# EAGLE design quad.decay.v1.0.2 (EAGLE 7.7.0)
VCA
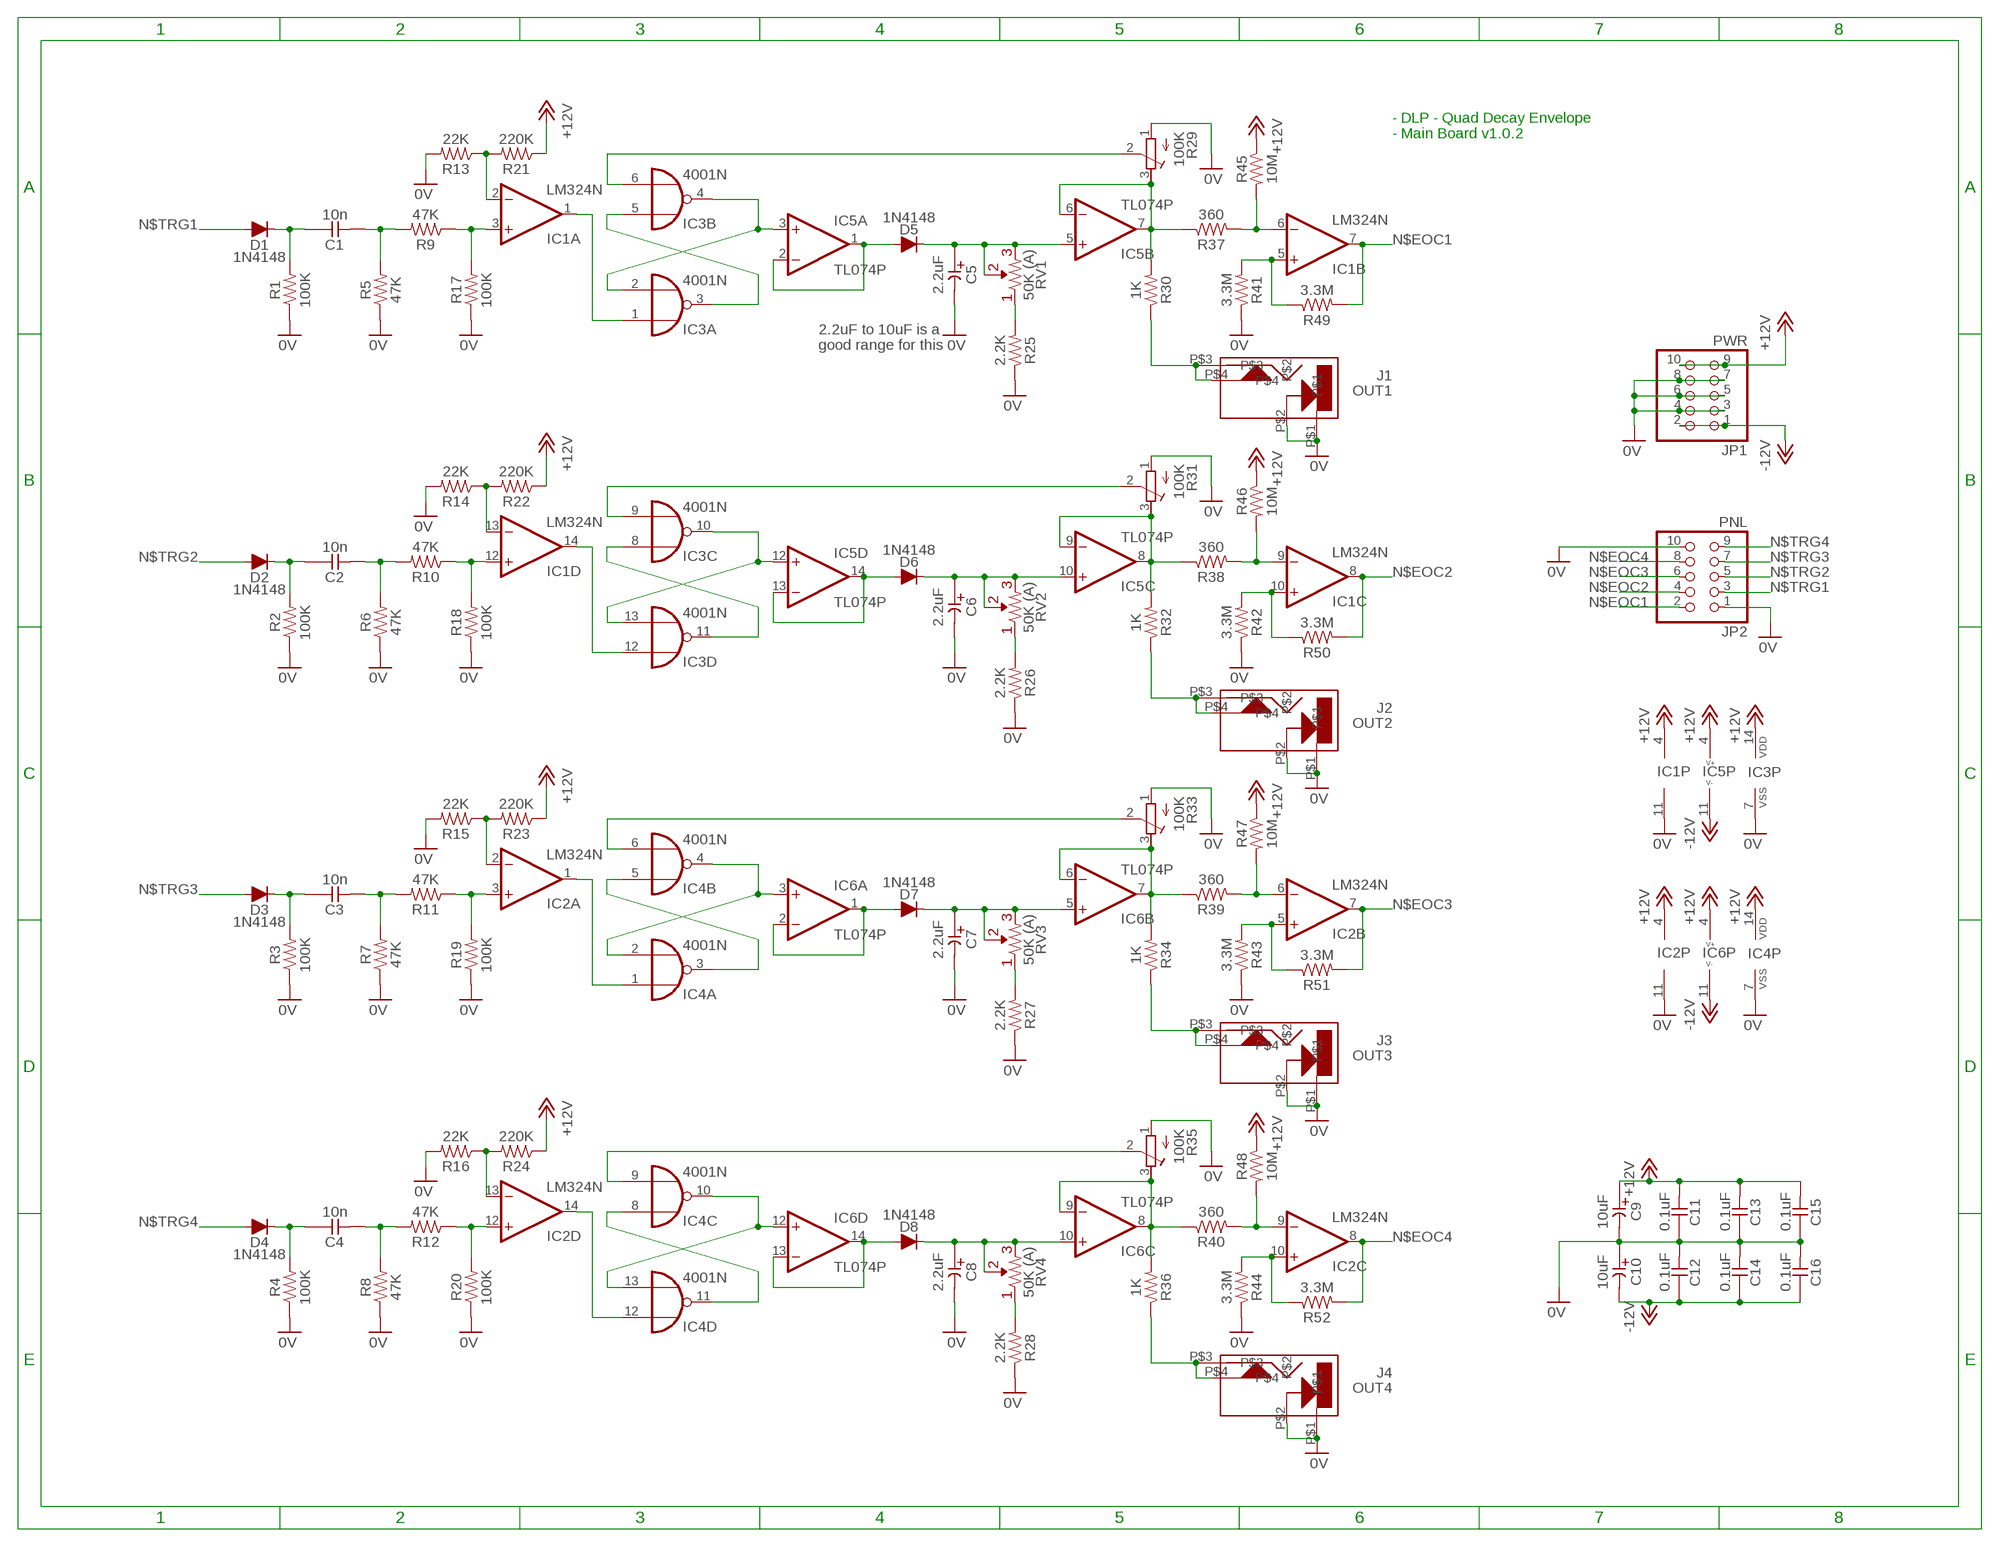
[diagram p0: schematic, sheet 1]

## Parts
C1  10n  CC-US025-024X044  [C025-024X044]
C2  10n  CC-US025-024X044  [C025-024X044]
C3  10n  CC-US025-024X044  [C025-024X044]
C4  10n  CC-US025-024X044  [C025-024X044]
C5  2.2uF  CE-USE2-5  [E2-5]
C6  2.2uF  CE-USE2-5  [E2-5]
C7  2.2uF  CE-USE2-5  [E2-5]
C8  2.2uF  CE-USE2-5  [E2-5]
C9  10uF  CE-USE2-5  [E2-5]
C10  10uF  CE-USE2-5  [E2-5]
C11  0.1uF  CC-US025-024X044  [C025-024X044]
C12  0.1uF  CC-US025-024X044  [C025-024X044]
C13  0.1uF  CC-US025-024X044  [C025-024X044]
C14  0.1uF  CC-US025-024X044  [C025-024X044]
C15  0.1uF  CC-US025-024X044  [C025-024X044]
C16  0.1uF  CC-US025-024X044  [C025-024X044]
D1  1N4148  [DO34-5]
D2  1N4148  [DO34-5]
D3  1N4148  [DO34-5]
D4  1N4148  [DO34-5]
D5  1N4148  [DO34-5]
D6  1N4148  [DO34-5]
D7  1N4148  [DO34-5]
D8  1N4148  [DO34-5]
IC1  LM324N  [DIL14]
IC2  LM324N  [DIL14]
IC3  4001N  [DIL14]
IC4  4001N  [DIL14]
IC5  TL074P  [DIL14]
IC6  TL074P  [DIL14]
J1  OUT1  CL1384  [CL1384]
J2  OUT2  CL1384  [CL1384]
J3  OUT3  CL1384  [CL1384]
J4  OUT4  CL1384  [CL1384]
JP1  PWR  PINHD-2X5  [2X05]
JP2  PNL  PINHD-2X5  [2X05]
R1  100K  R  [0207/7]
R2  100K  R  [0207/7]
R3  100K  R  [0207/7]
R4  100K  R  [0207/7]
R5  47K  R  [0207/7]
R6  47K  R  [0207/7]
R7  47K  R  [0207/7]
R8  47K  R  [0207/7]
R9  47K  R  [0207/7]
R10  47K  R  [0207/7]
R11  47K  R  [0207/7]
R12  47K  R  [0207/7]
R13  22K  R  [0207/7]
R14  22K  R  [0207/7]
R15  22K  R  [0207/7]
R16  22K  R  [0207/7]
R17  100K  R  [0207/7]
R18  100K  R  [0207/7]
R19  100K  R  [0207/7]
R20  100K  R  [0207/7]
R21  220K  R  [0207/7]
R22  220K  R  [0207/7]
R23  220K  R  [0207/7]
R24  220K  R  [0207/7]
R25  2.2K  R  [0207/7]
R26  2.2K  R  [0207/7]
R27  2.2K  R  [0207/7]
R28  2.2K  R  [0207/7]
R29  100K  R-TRIMM3339P  [RTRIM3339P]
R30  1K  R  [0207/7]
R31  100K  R-TRIMM3339P  [RTRIM3339P]
R32  1K  R  [0207/7]
R33  100K  R-TRIMM3339P  [RTRIM3339P]
R34  1K  R  [0207/7]
R35  100K  R-TRIMM3339P  [RTRIM3339P]
R36  1K  R  [0207/7]
R37  360  R  [0207/7]
R38  360  R  [0207/7]
R39  360  R  [0207/7]
R40  360  R  [0207/7]
R41  3.3M  R  [0207/7]
R42  3.3M  R  [0207/7]
R43  3.3M  R  [0207/7]
R44  3.3M  R  [0207/7]
R45  10M  R  [0207/7]
R46  10M  R  [0207/7]
R47  10M  R  [0207/7]
R48  10M  R  [0207/7]
R49  3.3M  R  [0207/7]
R50  3.3M  R  [0207/7]
R51  3.3M  R  [0207/7]
R52  3.3M  R  [0207/7]
RV1  50K (A)  R-VAR  [R-VAR]
RV2  50K (A)  R-VAR  [R-VAR]
RV3  50K (A)  R-VAR  [R-VAR]
RV4  50K (A)  R-VAR  [R-VAR]

## Nets
0V [pwr]: C5.- C6.- C7.- C8.- C9.- C10.+ C11.1 C12.2 C13.1 C14.2 C15.1 C16.2 IC1.11(P:V-) IC2.11(P:V-) IC3.7(P:VSS) IC4.7(P:VSS) J1.P$1 J1.P$2 J2.P$1 J2.P$2 J3.P$1 J3.P$2 J4.P$1 J4.P$2 JP1.3 JP1.4 JP1.5 JP1.6 JP1.7 JP1.8 JP2.1 JP2.10 R1.1 R2.1 R3.1 R4.1 R5.1 R6.1 R7.1 R8.1 R13.2 R14.2 R15.2 R16.2 R17.1 R18.1 R19.1 R20.1 R25.1 R26.1 R27.1 R28.1 R29.1(A) R31.1(A) R33.1(A) R35.1(A) R41.1 R42.1 R43.1 R44.1
+12V [pwr]: C9.+ C11.2 C13.2 C15.2 IC1.4(P:V+) IC2.4(P:V+) IC3.14(P:VDD) IC4.14(P:VDD) IC5.4(P:V+) IC6.4(P:V+) JP1.9 JP1.10 R21.1 R22.1 R23.1 R24.1 R45.1 R46.1 R47.1 R48.1
-12V [pwr]: C10.- C12.1 C14.1 C16.1 IC5.11(P:V-) IC6.11(P:V-) JP1.1 JP1.2
N$1: R25.2 RV1.R1
N$2: IC1.6(B:-IN) R37.2 R45.2
N$3: IC1.5(B:+IN) R41.2 R49.1
N$4: IC3.3(A:O) IC3.5(B:I0)
N$8: IC3.8(C:I0) IC3.11(D:O)
N$9: IC3.10(C:O) IC3.13(D:I1) IC5.12(D:+IN)
N$11: C2.1 D2.C R2.2
N$12: C2.2 R6.2 R10.2
N$13: IC1.12(D:+IN) R10.1 R18.2
N$14: IC3.2(A:I1) IC3.4(B:O) IC5.3(A:+IN)
N$16: IC1.13(D:-IN) R14.1 R22.2
N$17: D5.A IC5.1(A:OUT) IC5.2(A:-IN)
N$18: C1.1 D1.C R1.2
N$19: C1.2 R5.2 R9.2
N$20: IC1.3(A:+IN) R9.1 R17.2
N$21: IC1.2(A:-IN) R13.1 R21.2
N$22: IC1.1(A:OUT) IC3.1(A:I0)
N$23: IC5.6(B:-IN) IC5.7(B:OUT) R29.3(E) R30.2 R37.1
N$24: J1.P$3 J1.P$4 R30.1
N$25: IC3.6(B:I1) R29.2(S)
N$26: IC1.14(D:OUT) IC3.12(D:I0)
N$27: D6.A IC5.13(D:-IN) IC5.14(D:OUT)
N$28: IC5.8(C:OUT) IC5.9(C:-IN) R31.3(E) R32.2 R38.1
N$29: J2.P$3 J2.P$4 R32.1
N$30: IC3.9(C:I1) R31.2(S)
N$31: C6.+ D6.C IC5.10(C:+IN) RV2.R2 RV2.VAR
N$32: R26.2 RV2.R1
N$33: IC1.9(C:-IN) R38.2 R46.2
N$34: IC1.10(C:+IN) R42.2 R50.1
N$38: IC4.3(A:O) IC4.5(B:I0)
N$39: IC4.2(A:I1) IC4.4(B:O) IC6.3(A:+IN)
N$41: C3.1 D3.C R3.2
N$42: C3.2 R7.2 R11.2
N$43: IC2.3(A:+IN) R11.1 R19.2
N$44: IC2.2(A:-IN) R15.1 R23.2
N$45: IC2.1(A:OUT) IC4.1(A:I0)
N$46: D7.A IC6.1(A:OUT) IC6.2(A:-IN)
N$47: IC6.6(B:-IN) IC6.7(B:OUT) R33.3(E) R34.2 R39.1
N$48: J3.P$3 J3.P$4 R34.1
N$49: IC4.6(B:I1) R33.2(S)
N$50: C7.+ D7.C IC6.5(B:+IN) RV3.R2 RV3.VAR
N$51: R27.2 RV3.R1
N$52: IC2.6(B:-IN) R39.2 R47.2
N$53: IC2.5(B:+IN) R43.2 R51.1
N$57: IC4.8(C:I0) IC4.11(D:O)
N$58: IC4.10(C:O) IC4.13(D:I1) IC6.12(D:+IN)
N$60: C4.1 D4.C R4.2
N$61: C4.2 R8.2 R12.2
N$62: IC2.12(D:+IN) R12.1 R20.2
N$63: C5.+ D5.C IC5.5(B:+IN) RV1.R2 RV1.VAR
N$64: IC2.13(D:-IN) R16.1 R24.2
N$65: IC2.14(D:OUT) IC4.12(D:I0)
N$66: D8.A IC6.13(D:-IN) IC6.14(D:OUT)
N$67: IC6.8(C:OUT) IC6.9(C:-IN) R35.3(E) R36.2 R40.1
N$68: J4.P$3 J4.P$4 R36.1
N$69: IC4.9(C:I1) R35.2(S)
N$70: C8.+ D8.C IC6.10(C:+IN) RV4.R2 RV4.VAR
N$71: R28.2 RV4.R1
N$72: IC2.9(C:-IN) R40.2 R48.2
N$73: IC2.10(C:+IN) R44.2 R52.1
N$EOC1: IC1.7(B:OUT) JP2.2 R49.2
N$EOC2: IC1.8(C:OUT) JP2.4 R50.2
N$EOC3: IC2.7(B:OUT) JP2.6 R51.2
N$EOC4: IC2.8(C:OUT) JP2.8 R52.2
N$TRG1: D1.A JP2.3
N$TRG2: D2.A JP2.5
N$TRG3: D3.A JP2.7
N$TRG4: D4.A JP2.9

## Notes on the sheet
- - DLP - Quad Decay Envelope
  - Main Board v1.0.2
- 2.2uF to 10uF is a 
  good range for this

## Library data of the parts
C1-C4 C11-C16 = _common:CC-US: CAPACITOR, US symbol
C5-C10 = _common:CE-US: ELECTROLYTIC CAPACITOR, US symbol
D1-D8 = _common:1N4148: DIODE high speed (Philips)
IC1 IC2 = linear:LM324: OP AMP
IC3 IC4 = 40xx:4001: Quad 2-input NOR
IC5 IC6 = _common:TL074: OP AMP
J1-J4 = jacks:CL1384
JP1 JP2 = pinhead:PINHD-2X5: PIN HEADER
R1-R28 R30 R32 R34 R36-R52 = _common:R: RESISTOR, US symbol
R29 R31 R33 R35 = rcl:R-TRIMM: Trimm resistor
RV1-RV4 = _common:R-VAR

## Net classes
1 pwr: width 0.508 mm

## Board
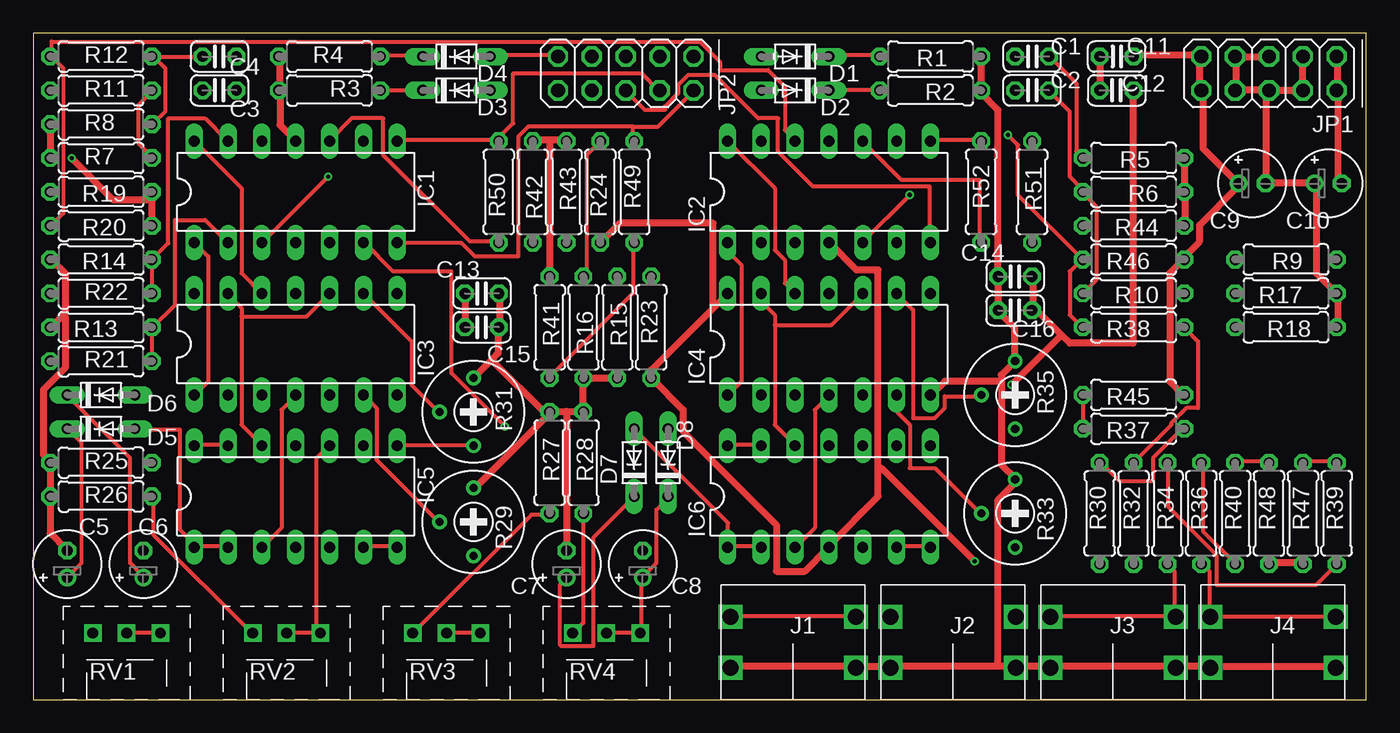
[diagram p1: board, top side]
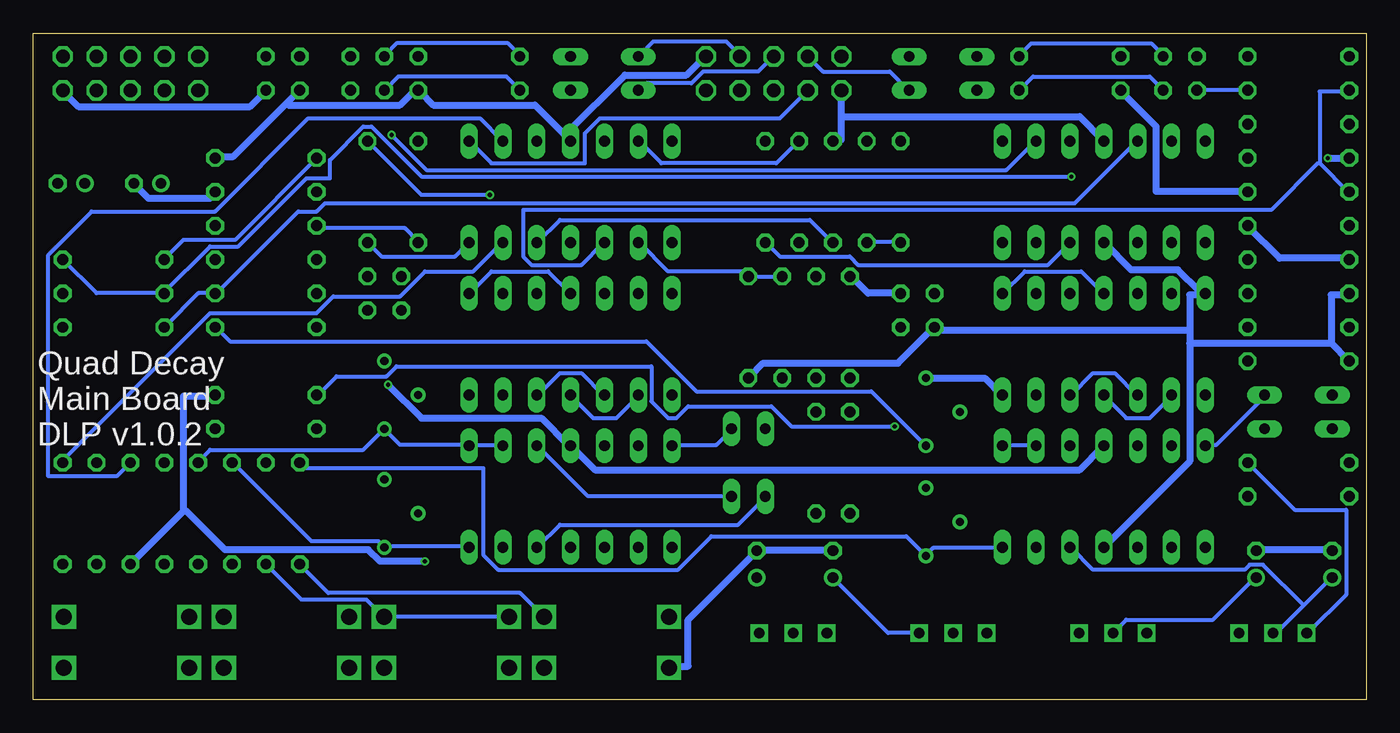
[diagram p2: board, bottom side, seen from below]

Size 100 x 50 mm. Coordinates in mm from the lower left corner, seen from the top.
Outline: 0,0 100,0 100,50 0,50 0,0
Copper layers (1*16): Top 0.035mm / dielectric 1.5mm / Bottom 0.035mm
Design rules "SeeedStudio_2layer_DRU_no_angle_20140221 *": minimum track width 12mil, minimum drill 12mil, track to track 6mil, track to pad 6mil, pad to pad 6mil, via to via 6mil, smd to smd 0mil, copper to edge 10mil, drill to drill 10mil, minimum pad ring 10mil, minimum via ring 6mil, stop-mask expansion 2mil, vias tented up to drill 100mil, thermal gap 10mil

### Footprints (pad centres in the part's own frame; a part is rotated, then mirrored left to right if it is on the bottom)
C025-024X044 = drill 0.813 octagon: 1 -1.27,0; 2 1.27,0
E2-5 = drill 0.813 pad 1.27: + -1.016,0 | drill 0.813 pad 1.27 octagon: - 1.016,0
DO34-5 = drill 0.813 long: A 2.54,0; C -2.54,0
DIL14 = drill 0.813 long: 1 -7.62,-3.81; 2 -5.08,-3.81; 3 -2.54,-3.81; 4 0,-3.81; 5 2.54,-3.81; 6 5.08,-3.81; 7 7.62,-3.81; 8 7.62,3.81; 9 5.08,3.81; 10 2.54,3.81; 11 0,3.81; 12 -2.54,3.81; 13 -5.08,3.81; 14 -7.62,3.81
CL1384 = drill 1.2 square: P$1 0,0; P$2 9.4,0; P$3 0,-3.8; P$4 9.4,-3.8
2X05 = drill 1.016 octagon: 1 -5.08,-1.27; 2 -5.08,1.27; 3 -2.54,-1.27; 4 -2.54,1.27; 5 0,-1.27; 6 0,1.27; 7 2.54,-1.27; 8 2.54,1.27; 9 5.08,-1.27; 10 5.08,1.27
0207/7 = drill 0.813 octagon: 1 -3.81,0; 2 3.81,0
RTRIM3339P = drill 0.61: 1 -2.54,0; 2 0,-2.54; 3 2.54,0
R-VAR = drill 0.8 square: R1 -2.54,0; R2 2.54,0; VAR 0,0

### Placement (x,y rotation side)
C1  74.93,48.26 0 top
C2  74.93,45.72 0 top
C3  13.97,45.72 180 top
C4  13.97,48.26 180 top
C5  2.54,10.16 90 top
C6  8.26,10.16 90 top
C7  40.01,10.16 90 top
C8  45.72,10.16 90 top
C9  91.44,38.73 0 top
C10  97.16,38.73 0 top
C11  81.28,48.26 0 top
C12  81.28,45.72 180 top
C13  33.66,30.48 180 top
C14  73.66,31.75 180 top
C15  33.66,27.94 180 top
C16  73.66,29.21 180 top
D1  57.15,48.26 180 top
D2  57.15,45.72 180 top
D3  31.75,45.72 0 top
D4  31.75,48.26 0 top
D5  5.08,20.32 0 top
D6  5.08,22.86 0 top
D7  45.09,17.78 90 top
D8  47.62,17.78 90 top
IC1  19.68,38.1 0 top
IC2  59.69,38.1 0 top
IC3  19.68,26.67 0 top
IC4  59.69,26.67 0 top
IC5  19.68,15.24 0 top
IC6  59.69,15.24 0 top
J1  61.7,2.4 180 top
J2  73.7,2.4 180 top
J3  85.7,2.4 180 top
J4  97.7,2.4 180 top
JP1  92.71,46.99 180 top
JP2  44.45,46.99 180 top
R1  67.31,48.26 180 top
R2  67.31,45.72 180 top
R3  22.23,45.72 0 top
R4  22.23,48.26 0 top
R5  82.55,40.64 180 top
R6  82.55,38.1 180 top
R7  5.08,40.64 0 top
R8  5.08,43.18 0 top
R9  93.98,33.02 180 top
R10  82.55,30.48 180 top
R11  5.08,45.72 0 top
R12  5.08,48.26 0 top
R13  5.08,27.94 180 top
R14  5.08,33.02 180 top
R15  43.81,27.94 270 top
R16  41.27,27.94 270 top
R17  93.98,30.48 180 top
R18  93.98,27.94 180 top
R19  5.08,38.1 180 top
R20  5.08,35.56 180 top
R21  5.08,25.4 0 top
R22  5.08,30.48 0 top
R23  46.35,27.94 90 top
R24  42.55,38.1 90 top
R25  5.08,17.78 0 top
R26  5.08,15.24 0 top
R27  38.73,17.78 270 top
R28  41.27,17.78 270 top
R29  33.02,13.34 270 top
R30  80.01,13.97 90 top
R31  33.02,21.59 270 top
R32  82.55,13.97 90 top
R33  73.66,13.97 270 top
R34  85.09,13.97 90 top
R35  73.66,22.86 270 top
R36  87.63,13.97 90 top
R37  82.55,20.32 180 top
R38  82.55,27.94 180 top
R39  97.79,13.97 90 top
R40  90.17,13.97 90 top
R41  38.73,27.94 270 top
R42  37.47,38.1 270 top
R43  40.01,38.1 270 top
R44  82.55,35.56 180 top
R45  82.55,22.86 180 top
R46  82.55,33.02 180 top
R47  95.25,13.97 90 top
R48  92.71,13.97 90 top
R49  45.09,38.1 90 top
R50  34.92,38.1 90 top
R51  74.93,38.1 270 top
R52  71.12,38.1 90 top
RV1  7,5 0 top
RV2  19,5 0 top
RV3  31,5 0 top
RV4  43,5 0 top

### Tracks (layer width: path | path; a pad name or v marks a point on that pad's centre or on a via)
0V  (via drill 0.3)
  Top 0.508: R1.1 71.12,45.75 R2.1 71.12,45.5 72.38,44.25 72.38,32 C14.2 72.38,31.75 72.38,29.25 C16.2 72.5,29 73.62,27.88 73.62,25.62 R35.1 73.62,25.38 72.62,24.38 72.62,23.88 | C12.2 80,45.75 C11.1 | R44.1 86.38,35.62 86.38,38 R6.1 86.38,38.25 86.38,40.62 R5.1 | JP1.6 92.62,45.75 90.25,45.75 JP1.8 90.25,46 90.25,48.25 JP1.7 90.5,48.25 92.62,48.25 JP1.5 | JP1.6 92.88,45.75 95.25,45.75 JP1.4 JP1.3 | R18.1 97.88,28 97.88,30.38 R17.1 97.62,30.62 96.25,32 96.25,38.5 C10.+ 96.12,38.75 92.5,38.75 C9.- 92.5,39 92.5,45.5 JP1.6 | C5.- 2.5,11.25 1.25,12.5 1.25,15 R26.1 1.25,15.25 1.25,17.75 R25.1 1.12,18 0.75,18.38 0.75,23.25 2.38,24.88 2.38,28.75 2.25,28.88 | IC1.11 19.62,42 18.5,43.12 18.5,45.62 R3.1 18.5,45.88 18.5,48.25 R4.1 | R7.1 1.25,40.75 1.25,43.12 R8.1 | R20.1 8.88,35.62 8.88,38 R19.1 8.62,37.5 6,37.5 v2.88,40.62 | 2.25,28.88 2.38,29 2.38,32 1.38,33 R14.2 | 2.25,28.88 1.38,28 R13.2 | R29.1 33.12,15.88 38.62,21.38 38.62,21.5 R27.1 | 40,21.62 38.88,21.62 R27.1 | 40,21.62 41.25,21.62 R28.1 41.25,21.88 41.25,24.12 R16.2 41.5,24.12 43.75,24.12 R15.2 | 40,21.62 40,11.25 C7.- | 38.75,42 40,42 R43.1 | 38.75,42 37.5,42 R42.1 | 34.38,25.5 34.88,26 34.88,27.88 C15.1 35,28.12 35,30.38 C13.1 | 34.38,25.5 33.12,24.25 R31.1 | 38.75,42 38.75,31.75 R41.1 | 34.38,25.5 38.38,21.5 R27.1 | 72.62,23.88 72.62,17.62 73.62,16.62 R33.1 73.62,16.25 72.38,15 72.38,2.5 | 72.62,23.88 68.38,23.88 67.38,22.88 IC4.7 | J1.P$2 52.38,2.5 61.62,2.5 J1.P$1 61.88,2.5 64.25,2.5 J2.P$2 64.5,2.5 72.38,2.5 | J4.P$1 97.62,2.5 88.5,2.5 J4.P$2 88.25,2.5 85.75,2.5 J3.P$1 85.5,2.5 76.5,2.5 J3.P$2 76.25,2.5 73.75,2.5 J2.P$1 73.5,2.5 72.38,2.5
  Bottom 0.508: JP2.1 49.62,48.25 51,46.88 55.62,46.88 60,42.5 IC2.11 59.75,42 62.38,44.62 70,44.62 71,45.62 R2.1 71.38,45.75 72.5,44.62 80.88,44.62 81,44.75 | 81,44.75 85,40.75 86.25,40.75 R5.1 | 81,44.75 80.12,45.62 C12.2 | R6.1 86.38,38 86.75,37.62 91.38,37.62 92.38,38.62 C9.- | C6.- 8.25,11.25 2.62,11.25 C5.- | R20.1 8.88,35.5 6.5,33.12 1.38,33.12 R14.2 | v2.88,40.62 1.38,40.62 R7.1 | R3.1 18.38,45.62 15.75,43 15.75,38.12 9,38.12 R19.1 | C7.- 40.12,11.25 45.62,11.25 C8.- 45.88,11 50.88,6 50.88,2.5 52.25,2.5 J1.P$2 | 39.38,43.75 39.38,42 40,42 R43.1 | 39.38,43.75 39.38,45.62 JP2.10 | IC3.7 27.38,22.88 28.62,24.12 33,24.12 R31.1 | R41.1 38.62,31.75 37.38,30.5 35,30.5 C13.1 | 39.38,43.75 21.5,43.75 19.75,42 IC1.11
+12V  (via drill 0.3)
  Top 0.508: C11.2 82.62,48.38 87.62,48.38 JP1.9 87.5,48.12 87.5,45.88 JP1.10 87.75,45.62 87.75,41.38 90.38,38.75 C9.+ 90.38,38.5 87.5,35.62 87.5,34.38 86.38,33.25 R46.1 86.25,33 85.25,32 85.25,23.88 86.25,22.88 R45.1 | R48.1 92.75,10.25 95.25,10.25 R47.1 | C15.2 32.38,28 32.38,30.38 C13.2 | 51.12,29.5 46.38,24.75 46.38,24.38 R23.1 46.38,24.12 48.75,21.75 48.75,20.12 55.75,13.12 55.75,9.62 57.88,9.62 59.62,11.38 IC6.4 59.75,11.62 63.38,15.25 63.38,17.38 | 51.12,29.5 52,30.38 IC4.14 | R24.1 42.62,34.38 44,35.75 51,35.75 51,29.62 51.12,29.5 | 63.38,17.38 63.38,32.25 61.75,32.25 59.75,34.25 IC2.4 | v70.62,10.38 63.62,17.38 63.38,17.38
  Bottom 0.508: 88.75,14.12 92.62,10.25 R48.1 | 88.75,14.12 88.75,22.75 86.38,22.75 R45.1 | 2.62,26.75 1.38,25.5 R21.1 | 2.62,26.75 2.62,30.38 1.38,30.38 R22.1 | 13.25,27.75 13.25,30.38 12.12,30.38 IC3.14 12.5,30.62 14.12,32.25 17.62,32.25 19.62,34.25 IC1.4 | 13.25,27.75 13.25,26.75 | 13.25,26.75 13.25,17.88 19.62,11.5 IC5.4 | 13.25,26.75 2.62,26.75 | R23.1 46.25,24.25 45.25,25.25 35.12,25.25 32.5,27.88 C15.2 32.25,27.75 13.25,27.75 | v70.62,10.38 74,10.38 74.88,11.25 85.62,11.25 88.5,14.12 88.75,14.12
-12V  (via drill 0.3)
  Top 0.508: C14.1 75,31.75 75,29.25 C16.1 75.25,29.25 77.12,27.38 | C10.- 98.12,38.75 97.88,39 97.88,45.62 JP1.2 97.88,45.88 97.88,48.25 JP1.1 | 77.12,27.38 77.75,26.75 82.5,26.75 82.5,45.62 C12.1 | 77.12,27.38 v73.38,23.62
  Bottom 0.508: IC5.11 19.75,19 21.5,17.25 57.88,17.25 59.62,19 IC6.11 59.88,19.12 61.88,21.12 70.88,21.12 v73.38,23.62 | C12.1 82.62,45.62 83.75,44.5 96.62,44.5 97.75,45.62 JP1.2
N$1
  Bottom 0.305: RV1.R1 4.38,5 1.5,7.88 1.5,14.25 5.38,14.25 8.88,17.75 R25.2
N$2  (via drill 0.3)
  Top 0.305: R37.2 78.75,20.38 78.75,22.75 R45.2 | v35.38,20.5 31.38,24.5 31.38,32.12 27,32.12 24.88,34.25 IC1.6
  Bottom 0.305: v35.38,20.5 43.12,20.5 44.62,22 50.88,22 51.75,21.12 52.38,21.12 53.62,22.38 53.62,25 72.75,25 73.5,24.25 77.25,24.25 78.62,22.88 R45.2
N$3
  Top 0.305: R41.2 38.75,24.25 45,30.5 45,34.25 R49.1
  Bottom 0.305: IC1.5 22.25,34.25 23.88,32.62 38.12,32.62 38.75,33.25 44,33.25 45,34.25 R49.1
N$4
  Bottom 0.305: IC3.3 17.25,22.88 18.88,24.5 20.5,24.5 22.12,22.88 IC3.5
N$8
  Bottom 0.305: IC3.11 19.75,30.5 21.38,32.12 25.62,32.12 27.25,30.5 IC3.8
N$9
  Top 0.305: 15.62,28.75 15.62,29.38 14.62,30.38 IC3.13 | 15.62,28.75 15.62,20.62 17.12,19.12 IC5.12 | 15.62,28.75 20.5,28.75 22.12,30.38 IC3.10
N$11
  Top 0.305: D2.C 59.75,45.75 63.5,45.75 R2.2
  Bottom 0.305: C2.1 73.62,45.75 72.62,46.75 64.5,46.75 63.5,45.75 R2.2
N$12
  Top 0.305: R10.2 78.75,30.5 79.75,31.5 79.75,37 78.75,38 R6.2 78.75,38.25 77.75,39.25 77.75,44.12 76.25,45.62 C2.2
N$13
  Bottom 0.305: IC1.12 17.25,41.88 21.88,37.25 78.12,37.25 78.75,36.62 80.12,36.62 86.25,30.5 R10.1 86.5,30.5 87.62,30.5 90.12,28 R18.2
N$14
  Top 0.305: IC5.3 17.25,11.5 18.62,12.88 18.62,21.75 19.62,22.75 IC3.4
  Bottom 0.305: IC3.2 14.62,22.75 16.25,21.12 18,21.12 19.62,22.75 IC3.4
N$16
  Top 0.305: R22.2 8.88,30.5 8.88,33 R14.1 9,33.12 10.12,34.25 10.12,43.62 12.88,43.62 14.5,42 IC1.13
N$17
  Top 0.305: IC5.2 14.5,11.5 12.12,11.5 IC5.1 12.12,11.62 11,12.75 11,20.25 7.62,20.25 D5.A
N$18
  Top 0.305: D1.C 59.75,48.38 63.5,48.38 R1.2
  Bottom 0.305: C1.1 73.62,48.38 72.75,49.25 64.38,49.25 63.5,48.38 R1.2
N$19
  Top 0.305: R5.2 78.62,40.75 78.25,41.12 78.25,46.25 76.25,48.25 C1.2
  Bottom 0.305: R9.2 90.12,33.12 88.75,34.5 84.88,34.5 78.75,40.62 R5.2
N$20  (via drill 0.3)
  Top 0.305: v22.12,39.25 17.25,34.38 IC1.3
  Bottom 0.305: v22.12,39.25 70.88,39.25 74.62,43 75.25,43 77.75,40.5 77.75,39.12 79.5,39.12 84.62,34 86.75,34 90.25,30.5 R17.2 90.38,30.5 95.25,30.5 97.75,33 R9.1
N$21
  Top 0.305: R21.2 8.88,25.5 8.88,27.88 R13.1 9,28 10.62,29.62 10.62,36 12.88,36 14.5,34.38 IC1.2
N$22
  Top 0.305: IC3.1 12.12,22.88 13.12,23.88 13.12,33.25 12.12,34.25 IC1.1
N$23
  Top 0.305: IC5.6 24.88,11.5 27.25,11.5 IC5.7 | R30.2 80.12,17.75 81.5,16.38 84,16.38 84,18.12 86.25,20.38 R37.1
  Bottom 0.305: IC5.7 27.38,11.38 32.5,11.38 33,10.88 R29.3 33.12,10.88 34.5,12.25 49.12,12.25 51.62,9.75 65.12,9.75 66.25,10.88 66.25,17.38 79.62,17.38 80,17.75 R30.2
N$24
  Top 0.305: J1.P$4 52.38,6.25 61.62,6.25 J1.P$3
  Bottom 0.305: J1.P$3 63.5,8 77.88,8 80,10.12 R30.1
N$25
  Top 0.305: IC3.6 25.75,21.88 25.75,18 30.38,13.38 R29.2
N$26
  Top 0.305: IC3.12 15.62,32 15.62,38.38 12.12,41.88 IC1.14
N$27
  Top 0.305: IC5.14 12.12,19.12 14.5,19.12 IC5.13
  Bottom 0.305: D6.A 7.62,22.75 11.25,19.12 12,19.12 IC5.14
N$28
  Top 0.305: R31.3 33,19.12 27.38,19.12 IC5.8 | R32.2 82.62,17.88 85.38,20.62 85.38,20.75 86.5,21.88 87.38,21.88 87.38,26.88 86.38,27.88 R38.1
  Bottom 0.305: IC5.9 24.88,19.12 27.25,19.12 IC5.8 | R31.3 33.12,19.12 37.12,23.12 50.25,23.12 54,26.88 85.25,26.88 86.25,27.88 R38.1
N$29
  Bottom 0.305: R32.1 82.5,10.12 79.88,7.5 75,7.5 J2.P$3 73.62,6.25 64.38,6.25 J2.P$4
N$30
  Top 0.305: R31.2 30.38,21.62 28.38,23.62 28.38,26.88 24.88,30.38 IC3.9
N$31
  Top 0.305: RV2.VAR RV2.R2 21.25,5.12 21.25,18.12 22.12,19 IC5.10 | D6.C 2.62,22.75 7.25,18.12 7.25,10.25 8.25,9.25 C6.+
  Bottom 0.305: RV2.VAR 18,6 11.5,6 8.38,9.12 C6.+
N$32
  Top 0.305: RV2.R1 16.38,5 9,12.38 9,15.12 R26.2
N$33  (via drill 0.3)
  Top 0.305: R38.2 78.62,28 77.75,28.88 77.75,32.12 78.62,33 R46.2 78.62,33.12 73.88,37.88 73.88,41.62 v73.12,42.38
  Bottom 0.305: v73.12,42.38 70.5,39.75 27,39.75 24.88,41.88 IC1.9
N$34
  Top 0.305: IC1.10 22.25,42 23.88,43.62 26.25,43.62 26.25,40.88 32.75,34.38 34.88,34.38 R50.1
  Bottom 0.305: R50.1 35,34.38 37.38,34.38 R42.2
N$38
  Bottom 0.305: IC4.3 57.25,22.88 58.88,24.5 60.5,24.5 62.12,22.88 IC4.5
N$39
  Top 0.305: IC6.3 57.25,11.5 58.62,12.88 58.62,21.75 59.62,22.75 IC4.4
  Bottom 0.305: IC4.2 54.62,22.75 56.25,21.12 58,21.12 59.62,22.75 IC4.4
N$41
  Top 0.305: D3.C 29.12,45.75 26.12,45.75 R3.2
  Bottom 0.305: C3.1 15.25,45.75 16.25,46.75 25,46.75 26,45.75 R3.2
N$42
  Top 0.305: R7.2 8.88,40.75 7.88,41.75 7.88,44.62 8.88,45.62 R11.2
  Bottom 0.305: C3.2 12.62,45.75 9,45.75 R11.2
N$43
  Bottom 0.305: 3.5,40.25 1.38,38.12 R19.2 | 3.5,40.25 3.5,45.62 1.38,45.62 R11.1 | IC2.3 57.25,34.25 58.88,32.62 62.62,32.62 63.25,33.25 63.25,36.75 7.12,36.75 3.62,40.25 3.5,40.25
N$44
  Bottom 0.305: R15.1 R23.2 46.5,31.75 46.88,32.12 52.38,32.12 54.5,34.25 IC2.2
N$45
  Top 0.305: IC4.1 52.12,22.88 53.12,23.88 53.12,32.62 52.12,33.62 52.12,34.25 IC2.1
N$46
  Top 0.305: IC6.2 54.5,11.5 52.12,11.5 IC6.1 52.12,11.62 52.12,13.25 45.12,20.25 D7.A
N$47
  Top 0.305: IC6.6 64.88,11.5 67.25,11.5 IC6.7 | R39.1 97.75,10.12 96.25,8.62 88.75,8.62 88.75,10.88 85.12,14.5 85.12,17.75 R34.2
  Bottom 0.305: IC6.7 67.38,11.5 73.62,11.5 R33.3 73.75,11.5 74.12,11.88 79.12,11.88 85,17.75 R34.2
N$48
  Top 0.305: R34.1 85.62,9.62 85.62,6.25 J3.P$3 85.5,6.25 76.38,6.25 J3.P$4
N$49
  Top 0.305: R33.2 71,14 67.62,17.38 65.75,17.38 65.75,20.62 64.88,21.5 64.88,22.75 IC4.6
N$50
  Top 0.305: RV3.R2 RV3.VAR | C7.+ 40,9.12 39.5,8.62 39.5,4.12 39.62,4 42,4 42,12.12 45,15.12 D7.C
  Bottom 0.305: RV3.R2 35.88,5 40,9.12 C7.+ | D7.C 45.12,15.12 47.12,13.12 60.5,13.12 62.12,11.5 IC6.5
N$51
  Top 0.305: RV3.R1 28.5,5 37.38,13.88 38.62,13.88 R27.2
N$52
  Top 0.305: R47.2 95.25,17.88 97.75,17.88 R39.2
  Bottom 0.305: IC2.6 64.88,34.25 67,32.12 70.62,32.12 72.5,30.25 77.5,30.25 78.75,29 86.75,29 97.88,17.88 R39.2
N$53  (via drill 0.3)
  Top 0.305: v65.75,37.88 62.25,34.38 IC2.5
  Bottom 0.305: R43.2 40.12,34.38 41.75,36 60.5,36 62.12,34.38 IC2.5 | v65.75,37.88 70.88,37.88 74.88,41.88 R51.1
N$57
  Bottom 0.305: IC4.11 59.75,30.5 61.38,32.12 65.62,32.12 67.25,30.5 IC4.8
N$58
  Top 0.305: 55.62,28.12 55.62,28.88 54.62,29.88 54.62,30.38 IC4.13 | 55.62,28.12 55.62,20.62 57.12,19.12 IC6.12 | IC4.10 59.88,28.12 55.62,28.12
N$60
  Top 0.305: D4.C 29.12,48.38 26.12,48.38 R4.2
  Bottom 0.305: C4.1 15.25,48.38 16.12,49.25 25.12,49.25 26,48.38 R4.2
N$61
  Top 0.305: R8.2 9,43.25 9.88,44.12 9.88,47.38 9,48.25 R12.2 9.12,48.25 12.62,48.25 C4.2
N$62
  Top 0.305: R20.2 1.38,35.62 2.25,36.5 2.25,47.38 1.38,48.25 R12.1 1.38,48.38 1.38,49.38 50,49.38 51.5,47.88 51.5,47.25 55.12,47.25 56.38,46 56.38,42.75 57.12,42 IC2.12
N$63
  Top 0.305: RV1.R2 RV1.VAR | D5.C 2.62,20.25 3.62,19.25 3.62,10.25 2.62,9.25 C5.+
  Bottom 0.305: 4.69,7.06 6.75,5 RV1.VAR | 4.69,7.06 2.62,9.12 C5.+ | 4.69,7.06 7.75,10.12 8.75,10.12 9.12,9.75 20.5,9.75 22.12,11.38 IC5.5
N$64
  Top 0.305: R16.1 41.38,31.75 41.5,31.88 41.5,40.88 42.5,41.88 R24.2
  Bottom 0.305: IC2.13 54.5,41.88 52.88,40.25 44.25,40.25 42.62,41.88 R24.2
N$65
  Top 0.305: IC4.12 57.12,30.5 56.38,31.25 56.38,33 55.62,33.75 55.62,38.38 52.12,41.88 IC2.14
N$66
  Top 0.305: IC6.14 52.12,19.12 54.5,19.12 IC6.13
  Bottom 0.305: D8.A 47.62,20.25 48.75,19.12 52,19.12 IC6.14
N$67
  Top 0.305: R40.1 90.12,10.25 87.75,12.62 87.75,17.75 R36.2
  Bottom 0.305: IC6.9 64.88,19.12 67.25,19.12 IC6.8 67.38,19.12 72.5,19.12 73.62,20.25 R35.3 73.75,20.25 75.25,18.75 86.75,18.75 87.62,17.88 R36.2
N$68
  Top 0.305: R36.1 87.75,10.12 88.25,9.62 88.25,6.25 J4.P$4 88.38,6.25 97.62,6.25 J4.P$3
N$69
  Top 0.305: IC4.9 66,29.25 66,21.12 67.62,21.12 68.38,21.88 68.38,22.75 71,22.75 R35.2
N$70
  Top 0.305: RV4.VAR RV4.R2 45.62,5.12 45.62,9.12 C8.+ 45.75,9.25 46.75,10.25 46.75,14.25 47.62,15.12 D8.C
  Bottom 0.305: IC6.10 62.12,19 58.38,15.25 D8.C
N$71
  Top 0.305: RV4.R1 40.5,5 41.25,5.75 41.25,13.88 R28.2
N$72
  Top 0.305: R40.2 90.25,17.88 92.62,17.88 R48.2
  Bottom 0.305: IC2.9 64.88,42 66.5,43.62 79.38,43.62 86.38,36.62 95.62,36.62 98.88,33.38 98.88,16.75 93.75,16.75 92.75,17.75 R48.2
N$73
  Top 0.305: IC2.10 62.25,41.88 65.12,39 71,39 71,34.38 R52.1
  Bottom 0.305: R44.2 78.62,35.5 78.5,35.38 72.12,35.38 71.12,34.38 R52.1
N$EOC1
  Top 0.305: 45,43 37.12,43 36.38,42.25 36.38,33.25 33.12,33.25 32.12,34.25 27.38,34.25 IC1.7 | 45,43 45,42 R49.2 | 45,43 46.88,43 49.5,45.62 JP2.2
N$EOC2
  Top 0.305: IC1.8 27.38,42 34.88,42 R50.2 34.88,42.12 36,43.25 36,47 45.62,47 46.88,45.75 JP2.4
N$EOC3
  Top 0.305: JP2.6 44.5,45.62 45.88,44.25 47.38,44.25 47.38,44.5 48.38,45.5 48.38,46.12 49.12,46.88 51.12,46.88 54.38,43.62 55.88,43.62 55.88,41.12 58.5,38.5 67.25,38.5 67.25,34.38 IC2.7
  Bottom 0.305: IC2.7 67.38,34.25 68.38,33.25 73.88,33.25 74.88,34.25 R51.2
N$EOC4
  Top 0.305: IC2.8 67.38,42 71,42 R52.2
  Bottom 0.305: JP2.8 42,45.62 44,43.62 57.5,43.62 58.62,42.5 58.62,40.25 65.62,40.25 67.25,41.88 IC2.8
N$TRG1
  Bottom 0.305: D1.A 54.5,48.38 53.5,49.38 48,49.38 47,48.38 JP2.3
N$TRG2
  Bottom 0.305: D2.A 54.5,45.75 54,46.25 50.62,46.25 49.75,47.12 45.62,47.12 44.5,48.25 JP2.5
N$TRG3
  Bottom 0.305: D3.A 34.38,45.75 35.75,47.12 40.75,47.12 41.88,48.25 JP2.7
N$TRG4
  Top 0.305: D4.A 34.38,48.38 39.25,48.38 JP2.9

### Text on the board
bNames: Quad Decay / Main Board / DLP v1.0.2